# EAGLE design led_strip-esp32_video_PCB (EAGLE 9.6.2)
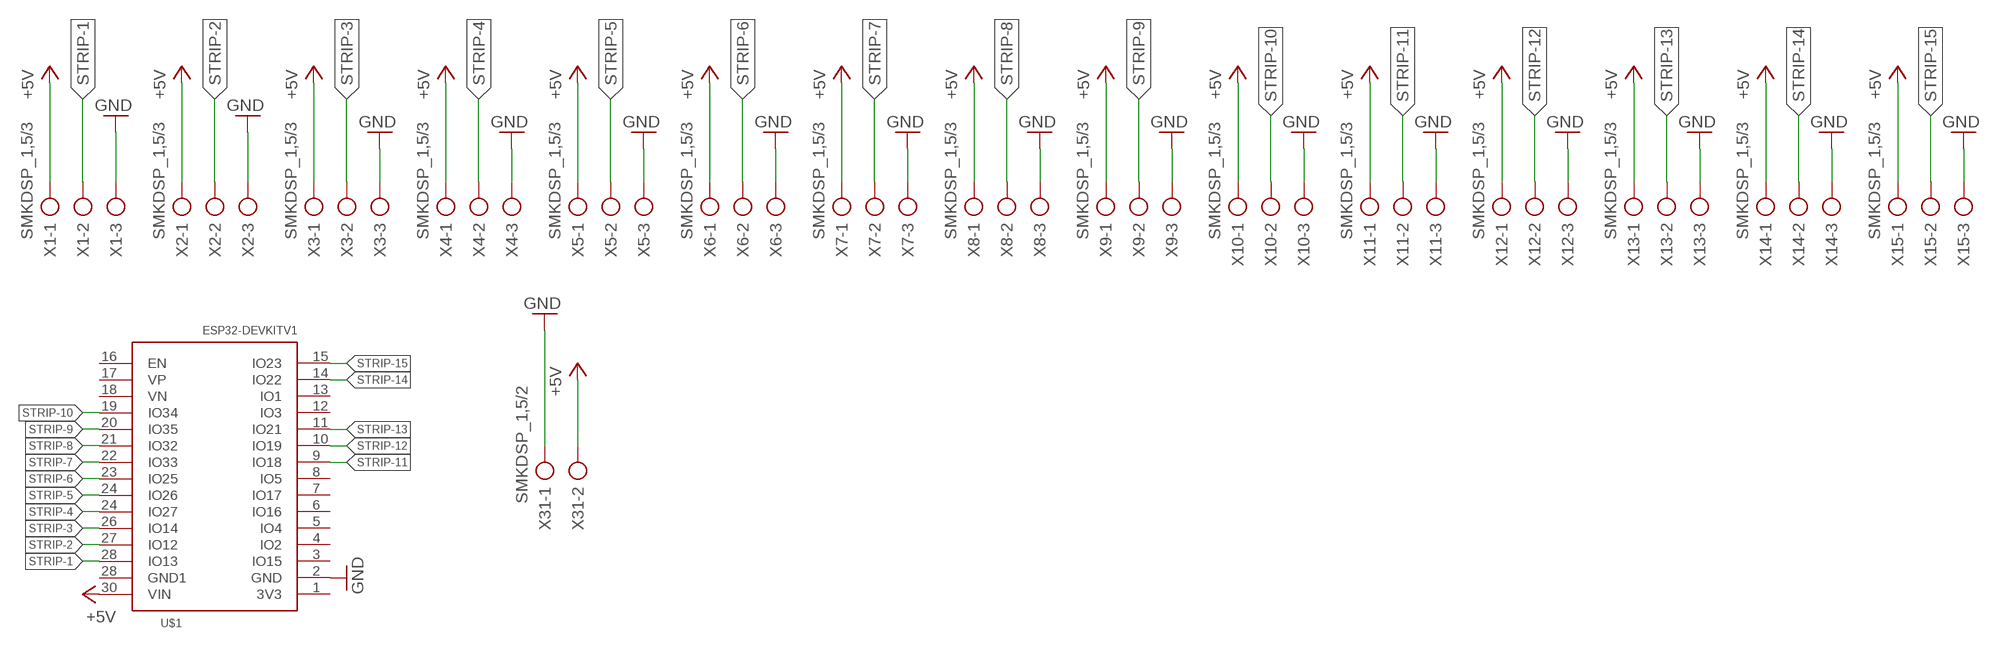
[diagram p0: schematic, sheet 1]

## Parts
U$1  ESP32DEVKITV1  [ESP32-DEVKITV1]
X1  SMKDSP_1,5/3  [SMKDSP_1,5/3]
X2  SMKDSP_1,5/3  [SMKDSP_1,5/3]
X3  SMKDSP_1,5/3  [SMKDSP_1,5/3]
X4  SMKDSP_1,5/3  [SMKDSP_1,5/3]
X5  SMKDSP_1,5/3  [SMKDSP_1,5/3]
X6  SMKDSP_1,5/3  [SMKDSP_1,5/3]
X7  SMKDSP_1,5/3  [SMKDSP_1,5/3]
X8  SMKDSP_1,5/3  [SMKDSP_1,5/3]
X9  SMKDSP_1,5/3  [SMKDSP_1,5/3]
X10  SMKDSP_1,5/3  [SMKDSP_1,5/3]
X11  SMKDSP_1,5/3  [SMKDSP_1,5/3]
X12  SMKDSP_1,5/3  [SMKDSP_1,5/3]
X13  SMKDSP_1,5/3  [SMKDSP_1,5/3]
X14  SMKDSP_1,5/3  [SMKDSP_1,5/3]
X15  SMKDSP_1,5/3  [SMKDSP_1,5/3]
X31  SMKDSP_1,5/2  [SMKDSP_1,5/2]

## Nets
+5V: U$1.30(VIN) X1.1 X2.1 X3.1 X4.1 X5.1 X6.1 X7.1 X8.1 X9.1 X10.1 X11.1 X12.1 X13.1 X14.1 X15.1 X31.2
GND: U$1.2(GND) X1.3 X2.3 X3.3 X4.3 X5.3 X6.3 X7.3 X8.3 X9.3 X10.3 X11.3 X12.3 X13.3 X14.3 X15.3 X31.1
STRIP-1: U$1.28(IO13) X1.2
STRIP-2: U$1.27(IO12) X2.2
STRIP-3: U$1.26(IO14) X3.2
STRIP-4: U$1.24(IO27) X4.2
STRIP-5: U$1.24(IO26) X5.2
STRIP-6: U$1.23(IO25) X6.2
STRIP-7: U$1.22(IO33) X7.2
STRIP-8: U$1.21(IO32) X8.2
STRIP-9: U$1.20(IO35) X9.2
STRIP-10: U$1.19(IO34) X10.2
STRIP-11: U$1.9(IO18) X11.2
STRIP-12: U$1.10(IO19) X12.2
STRIP-13: U$1.11(IO21) X13.2
STRIP-14: U$1.14(IO22) X14.2
STRIP-15: U$1.15(IO23) X15.2
Unconnected: U$1.1(3V3) U$1.3(IO15) U$1.4(IO2) U$1.5(IO4) U$1.6(IO16) U$1.7(IO17) U$1.8(IO5) U$1.12(IO3) U$1.13(IO1) U$1.16(EN) U$1.17(VP) U$1.18(VN) U$1.28(GND1)

## Library data of the parts
U$1 = ESP32-DEVKITV1:ESP32DEVKITV1
X1-X15 = con-phoenix-smkdsp:SMKDSP_1,5/3: Printklemme, Nennstrom: 17,5 A, Bemessungsspannung: 250 V, Raster: 5,0 mm Source: http://eshop.phoenixcontact.de .. 1733415.pdf; MF: FARNELL; MPN: 1733583; OC_FARNELL: 3041256; OC_NEWARK: 71C4130
X31 = con-phoenix-smkdsp:SMKDSP_1,5/2: Printklemme, Nennstrom: 17,5 A, Bemessungsspannung: 250 V, Raster: 5,0 mm Source: http://eshop.phoenixcontact.de .. 1733415.pdf; MF: FARNELL; MPN: 1733570; OC_FARNELL: 3041244; OC_NEWARK: 69C8588

## Board
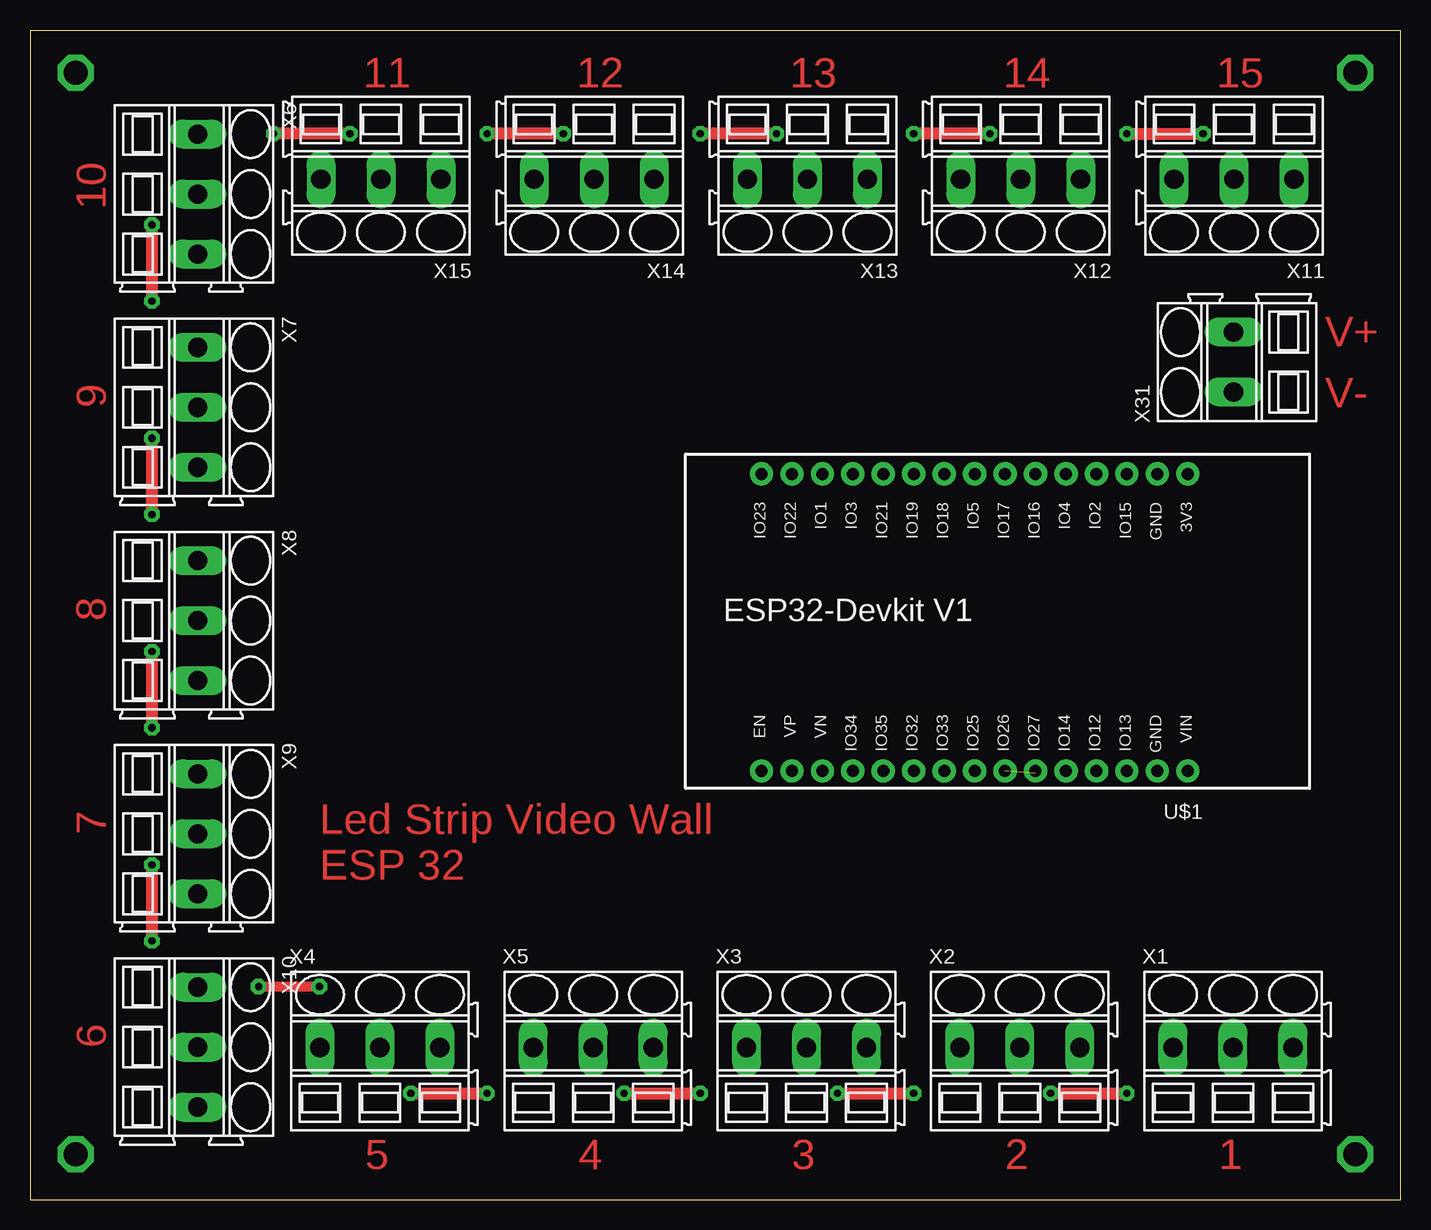
[diagram p1: board, top side]
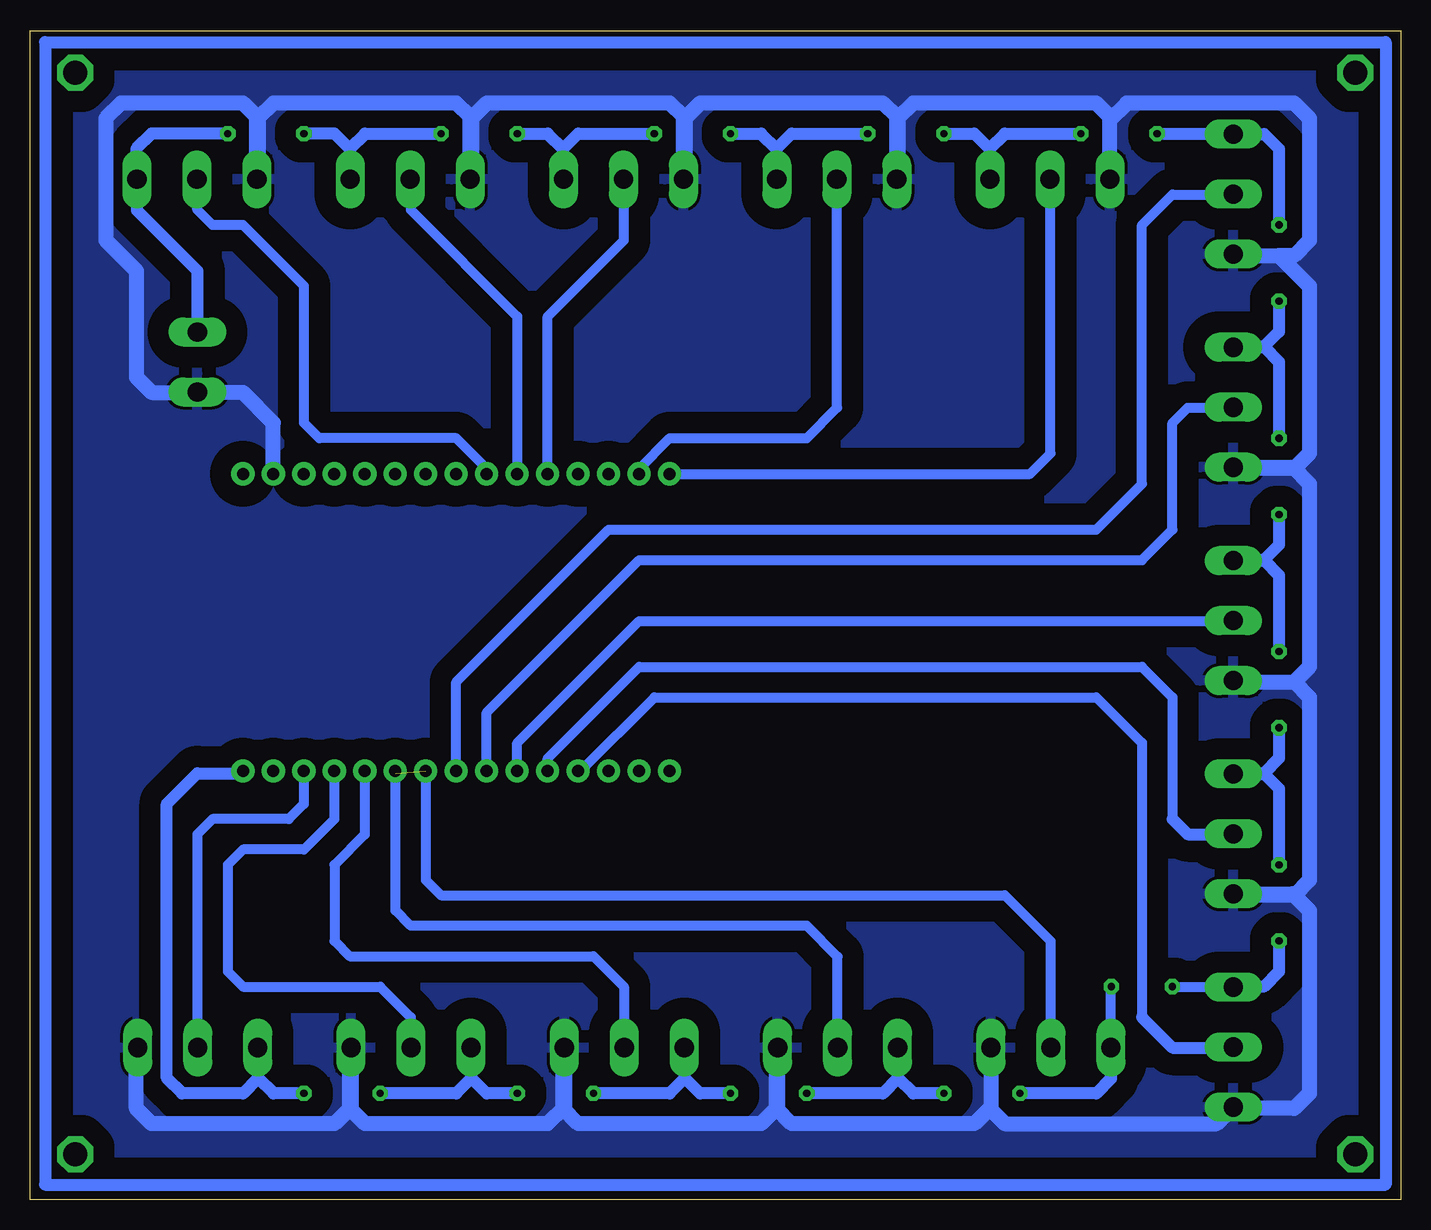
[diagram p2: board, bottom side, seen from below]

Size 114.28 x 97.46 mm. Coordinates in mm from the lower left corner, seen from the top.
Outline: 0,0 114.28,0 114.28,97.46 0,97.46 0,0
Copper layers (1*16): Top 0.035mm / dielectric 1.5mm / Bottom 0.035mm
Design rules "default": minimum track width 10mil, minimum drill 24mil, track to track 8mil, track to pad 8mil, pad to pad 8mil, via to via 8mil, smd to smd 8mil, copper to edge 40mil, drill to drill 8mil, minimum pad ring 10mil, minimum via ring 8mil, stop-mask expansion 4mil, vias tented up to drill 0mil, thermal gap 10mil

### Footprints (pad centres in the part's own frame; a part is rotated, then mirrored left to right if it is on the bottom)
ESP32-DEVKITV1 = drill 1 pad 1.93: 1 -22.87,-13.54; 2 -20.33,-13.54; 3 -17.79,-13.54; 4 -15.25,-13.54; 5 -12.71,-13.54; 6 -10.17,-13.54; 7 -7.63,-13.54; 8 -5.09,-13.54; 9 -2.55,-13.54; 10 -0.01,-13.54; 11 2.53,-13.54; 12 5.07,-13.54; 13 7.61,-13.54; 14 10.15,-13.54; 15 12.69,-13.54; 16 12.69,11.23; 17 10.15,11.23; 18 7.61,11.23; 19 5.07,11.23; 20 2.53,11.23; 21 -0.01,11.23; 22 -2.55,11.23; 23 -5.09,11.23; 24 -7.63,11.23; 25 -10.17,11.23; 26 -12.71,11.23; 27 -15.25,11.23; 28 -17.79,11.23; 29 -20.33,11.23; 30 -22.87,11.23
SMKDSP_1,5/3 = drill 1.6 pad 1.8 long: 1 -2.5,0; 2 2.5,0; 3 7.5,0
SMKDSP_1,5/2 = drill 1.6 pad 1.8 long: 1 -2.5,0; 2 2.5,0

### Placement (x,y rotation side)
U$1  73.66,46.99 180 top
X1  97.79,12.7 0 top
X2  80.01,12.7 0 top
X3  62.23,12.7 0 top
X4  26.67,12.7 0 top
X5  44.45,12.7 0 top
X6  13.97,86.36 270 top
X7  13.97,68.58 270 top
X8  13.97,50.8 270 top
X9  13.97,33.02 270 top
X10  13.97,15.24 270 top
X11  102.87,85.09 180 top
X12  85.09,85.09 180 top
X13  67.31,85.09 180 top
X14  49.53,85.09 180 top
X15  31.75,85.09 180 top
X31  100.33,69.85 90 top

### Tracks (layer width: path | path; a pad name or v marks a point on that pad's centre or on a via)
+5V  (via drill 0.6 pad 1.27)
  Top 0.813: v24.13,17.78 v19.05,17.78
  Top 1.016: v91.44,88.9 v97.79,88.9 | v80.01,88.9 v73.66,88.9 | v62.23,88.9 v55.88,88.9 | v44.45,88.9 v38.1,88.9 | v26.67,88.9 v20.32,88.9 | v10.16,81.28 v10.16,74.93 | v10.16,63.5 v10.16,57.15 | v10.16,45.72 v10.16,39.37 | v10.16,27.94 v10.16,21.59 | v31.75,8.89 v38.1,8.89 | v49.53,8.89 v55.88,8.89 | v67.31,8.89 v73.66,8.89 | v85.09,8.89 v91.44,8.89
  Bottom 0.813: X4.1 24.17,17.74 v24.13,17.78 | v19.05,17.78 14.01,17.78 X10.1 | 69.85,85.09 X13.1
  Bottom 1.016: X31.2 100.33,77.47 105.37,82.51 X11.1 105.41,85.13 105.41,87.63 104.14,88.9 v97.79,88.9 | v91.44,88.9 88.9,88.9 87.59,87.59 X12.1 87.59,87.67 86.36,88.9 v80.01,88.9 | v73.66,88.9 71.12,88.9 69.85,87.63 | 69.85,85.09 69.85,87.63 | 69.85,87.63 68.58,88.9 v62.23,88.9 | v55.88,88.9 53.34,88.9 52.07,87.63 52.07,85.13 X14.1 52.03,87.67 50.8,88.9 v44.45,88.9 | v38.1,88.9 35.56,88.9 34.29,87.63 34.29,85.13 X15.1 34.25,87.67 33.02,88.9 v26.67,88.9 | v20.32,88.9 14.01,88.9 X6.1 11.39,88.86 10.16,87.63 v10.16,81.28 | v10.16,74.93 10.16,72.39 11.43,71.12 13.93,71.12 X7.1 11.39,71.08 10.16,69.85 v10.16,63.5 | v10.16,57.15 10.16,54.61 11.43,53.34 13.93,53.34 X8.1 11.39,53.3 10.16,52.07 v10.16,45.72 | v10.16,39.37 10.16,36.83 11.43,35.56 13.93,35.56 X9.1 11.39,35.52 10.16,34.29 v10.16,27.94 | v10.16,21.59 10.16,19.05 11.43,17.78 13.93,17.78 X10.1 | X4.1 24.17,10.12 25.4,8.89 v31.75,8.89 | v38.1,8.89 40.64,8.89 41.91,10.16 41.91,12.66 X5.1 41.95,10.12 43.18,8.89 v49.53,8.89 | v55.88,8.89 58.42,8.89 59.69,10.16 59.69,12.66 X3.1 59.73,10.12 60.96,8.89 v67.31,8.89 | v73.66,8.89 76.2,8.89 77.47,10.16 77.47,12.66 X2.1 77.51,10.12 78.74,8.89 v85.09,8.89 | v91.44,8.89 93.98,8.89 95.25,10.16 95.25,12.66 X1.1 95.29,10.12 96.52,8.89 101.6,8.89 102.87,10.16 102.87,33.02 100.33,35.56 96.73,35.56 U$1.30
GND
  Bottom 1.27: 10.16,78.74 8.89,78.74 7.62,80.01 7.62,90.17 8.89,91.44 22.86,91.44 24.25,90.05 X15.3 24.25,90.29 25.4,91.44 40.64,91.44 41.91,90.17 41.91,85.21 X14.3 42.03,90.29 43.18,91.44 58.42,91.44 59.69,90.17 59.69,85.21 X13.3 59.81,90.29 60.96,91.44 76.2,91.44 77.47,90.17 77.47,85.21 X12.3 77.59,90.29 78.74,91.44 93.98,91.44 95.25,90.17 95.25,85.21 X11.3 95.37,90.29 96.52,91.44 106.68,91.44 107.95,90.17 107.95,80.01 105.41,77.47 105.41,68.58 104.14,67.31 100.37,67.31 X31.1 100.29,67.31 96.52,67.31 93.99,64.78 U$1.2 | X6.3 13.85,78.74 10.16,78.74 | 10.16,78.74 7.62,76.2 7.62,62.23 8.89,60.96 13.85,60.96 X7.3 9.01,61.08 7.62,59.69 7.62,44.45 8.89,43.18 | X8.3 13.85,43.18 8.89,43.18 | 8.89,43.18 7.62,41.91 7.62,26.67 8.89,25.4 13.85,25.4 X9.3 9.01,25.52 7.62,24.13 7.62,8.89 8.89,7.62 13.85,7.62 X10.3 15.36,6.35 33.02,6.35 34.17,7.5 X4.3 34.17,7.74 35.56,6.35 50.8,6.35 52.07,7.62 52.07,12.58 X5.3 51.95,7.74 53.34,6.35 68.58,6.35 69.85,7.62 69.85,12.58 X3.3 69.73,7.74 71.12,6.35 86.36,6.35 87.63,7.62 87.63,12.58 X2.3 87.51,7.74 88.9,6.35 104.14,6.35 105.41,7.62 105.41,12.58 X1.3
  pour Bottom (isolate 1.778): 7.62,95.25 111.76,95.25 111.76,2.54 2.54,2.54 2.54,93.98 2.54,95.25
N$1
  Bottom 1.016: 113.03,96.52 113.03,1.27 1.27,1.27 1.27,96.52 113.03,96.52
N$2  (via drill 2 pad 1.27)
  other vias: 3.81,93.98
N$3  (via drill 2 pad 1.27)
  other vias: 3.81,3.81
N$4  (via drill 2 pad 1.27)
  other vias: 110.49,3.81
N$5  (via drill 2 pad 1.27)
  other vias: 110.49,93.98
STRIP-1
  Bottom 0.813: U$1.28 91.45,33.01 92.71,31.75 99.06,31.75 100.33,30.48 100.33,14.01 X1.2
STRIP-2
  Bottom 0.813: U$1.27 88.91,31.74 91.44,29.21 96.52,29.21 97.79,27.94 97.79,19.05 96.52,17.78 85.09,17.78 82.55,15.24 82.55,14.01 X2.2
STRIP-3
  Bottom 0.813: U$1.26 86.37,30.47 88.9,27.94 88.9,21.59 87.63,20.32 67.31,20.32 64.77,17.78 64.77,14.01 X3.2
STRIP-4
  Bottom 0.813: U$1.24 81.29,26.68 80.01,25.4 33.02,25.4 29.21,21.59 29.21,14.01 X4.2
STRIP-5  (1 unrouted)
  Bottom 0.813: X5.2 46.95,20.28 49.53,22.86 82.55,22.86 83.82,24.13 83.82,35.56
STRIP-6
  Bottom 0.813: X6.2 14.01,83.82 19.05,83.82 21.59,81.28 21.59,59.69 25.4,55.88 66.04,55.88 78.75,43.17 U$1.23
STRIP-7
  Bottom 0.813: X7.2 14.01,66.04 17.78,66.04 19.05,64.77 19.05,55.88 21.59,53.34 63.5,53.34 76.21,40.63 U$1.22
STRIP-8
  Bottom 0.813: U$1.21 73.67,38.09 63.5,48.26 14.01,48.26 X8.2
STRIP-9
  Bottom 0.813: U$1.20 71.13,36.82 63.5,44.45 21.59,44.45 19.05,41.91 19.05,31.75
  Bottom 1.016: 19.05,31.75 17.78,30.48 14.01,30.48 X9.2
STRIP-10
  Bottom 0.813: 21.59,15.24 21.59,38.1 25.4,41.91 62.23,41.91 68.38,35.76 U$1.19
  Bottom 1.016: 21.59,15.24 19.05,12.7 14.01,12.7 X10.2
STRIP-11
  Bottom 0.813: X11.2 100.33,85.05 100.33,82.55 99.06,81.28 96.52,81.28 91.44,76.2 91.44,64.77 90.17,63.5 78.74,63.5 76.21,60.97 U$1.9
STRIP-12
  Bottom 0.813: U$1.10 73.66,73.66 82.55,82.55 82.55,85.05 X12.2
STRIP-13
  Bottom 0.813: U$1.11 71.13,73.65 64.77,80.01 64.77,85.09 X13.2
STRIP-14
  Bottom 0.813: U$1.14 63.51,60.95 60.96,63.5 49.53,63.5 46.99,66.04 46.99,85.05 X14.2
STRIP-15
  Bottom 0.813: U$1.15 30.91,60.53 29.21,62.23 29.21,85.09 X15.2

### Text on the board
Top: 11 | 12 | 13 | 14 | 15 | 10 | V+ | 9 | V- | 8 | 7 | Led Strip Video Wall | ESP 32 | 6 | 5 | 4 | 3 | 2 | 1